# EAGLE design LowduinoPTH (EAGLE 7.2.0)
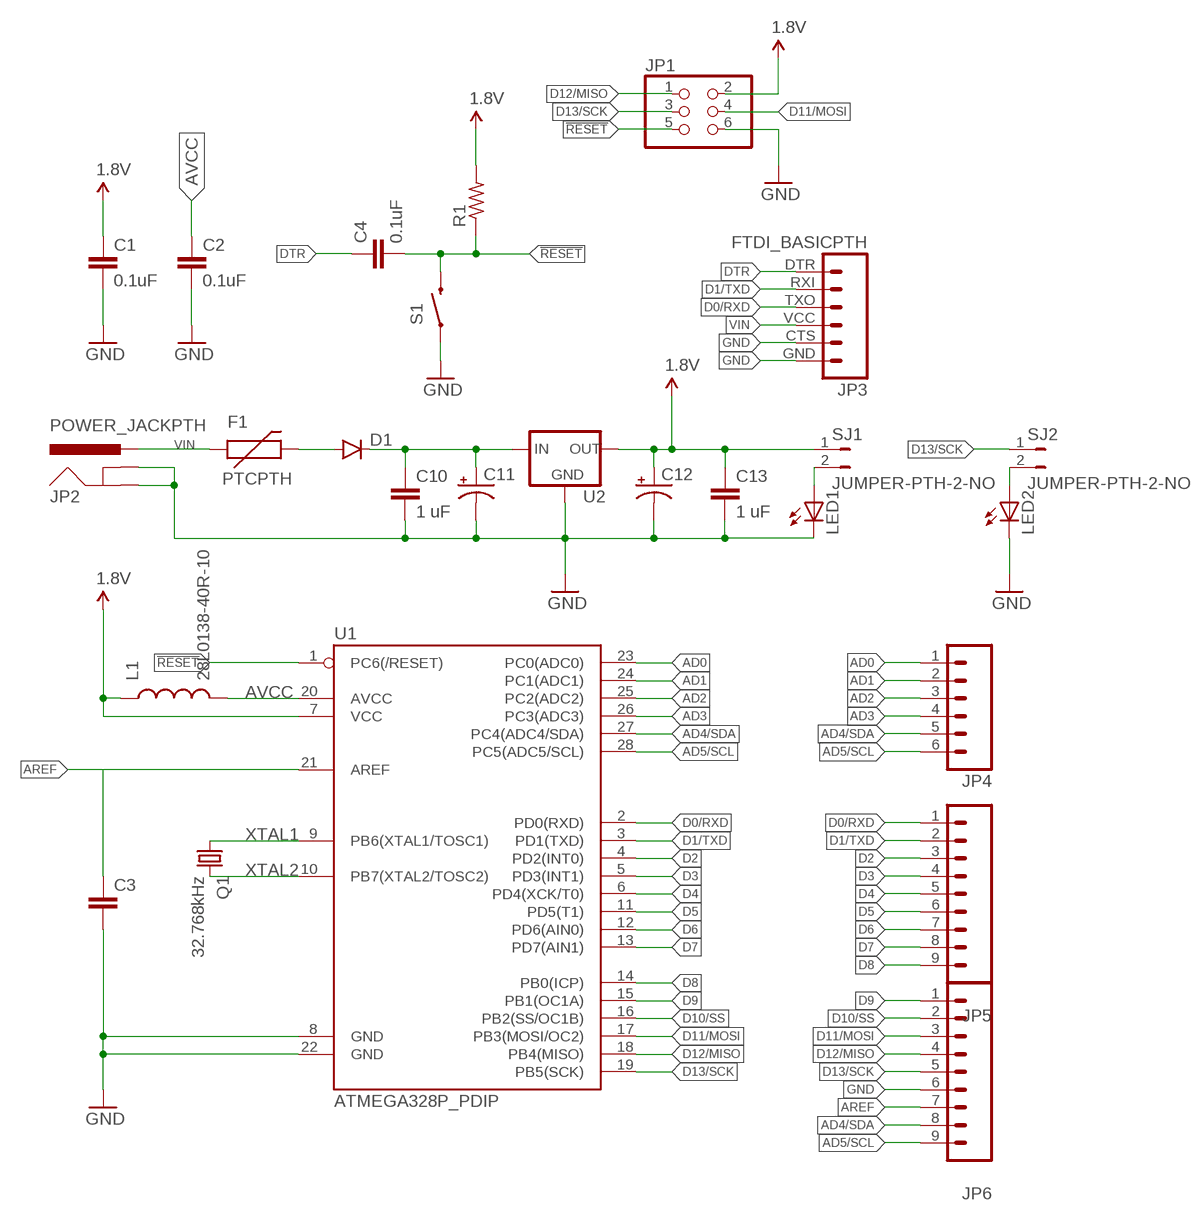
[diagram p0: schematic, sheet 1]

## Parts
C1  0.1uF  CAPPTH2  [CAP-PTH-SMALL2]
C2  0.1uF  CAPPTH1  [CAP-PTH-5MM]
C3  CAPPTH2  [CAP-PTH-SMALL2]
C4  0.1uF  CAPPTH3  [CAP-PTH-LARGE]
C10  1 uF  CAPPTH2  [CAP-PTH-SMALL2]
C11  CPOL-USE2.5-6  [E2,5-6]
C12  CPOL-USE2.5-6  [E2,5-6]
C13  1 uF  CAPPTH2  [CAP-PTH-SMALL2]
D1  DIODEPTH  [DIODE-1N4001]
F1  PTCPTH  [PTC]
JP1  PINHD-2X3  [2X03]
JP2  POWER_JACKPTH  [POWER_JACK_PTH]
JP3  FTDI_BASICPTH  [FTDI_BASIC]
JP4  M06SILK_FEMALE_PTH  [1X06]
JP5  M09  [1X09]
JP6  M09  [1X09]
L1  28L0138-40R-10  INDUCTORAXIAL-0.6  [AXIAL-0.6]
LED1  LED3MM  [LED3MM]
LED2  LED3MM  [LED3MM]
Q1  32.768kHz  CRYSTALTC26H  [TC26H]
R1  R-US_0207/10  [0207/10]
S1  SWITCH-MOMENTARY-2PTH  [TACTILE-PTH]
SJ1  JUMPER-PTH-2-NO  [PTH-JUMPER-2-NO_NO_SILK]
SJ2  JUMPER-PTH-2-NO  [PTH-JUMPER-2-NO_NO_SILK]
U1  ATMEGA328P_PDIP  [DIL28-3]
U2  V_REG_78XXTO-92_UNTESTED  [TO-92]

## Nets
1.8V: C1.1 C12.+ C13.1 JP1.2 L1.P$1 R1.2 SJ1.1 U1.7(VCC) U2.3(OUT)
!RESET: C4.2 JP1.5 R1.1 S1.3 U1.1(PC6(/RESET))
AD0: JP4.1 U1.23(PC0(ADC0))
AD1: JP4.2 U1.24(PC1(ADC1))
AD2: JP4.3 U1.25(PC2(ADC2))
AD3: JP4.4 U1.26(PC3(ADC3))
AD4/SDA: JP4.5 JP6.8 U1.27(PC4(ADC4/SDA))
AD5/SCL: JP4.6 JP6.9 U1.28(PC5(ADC5/SCL))
AREF: C3.1 JP6.7 U1.21(AREF)
AVCC: C2.1 L1.P$2 U1.20(AVCC)
D0/RXD: JP3.TXO JP5.1 U1.2(PD0(RXD))
D1/TXD: JP3.RXI JP5.2 U1.3(PD1(TXD))
D2: JP5.3 U1.4(PD2(INT0))
D3: JP5.4 U1.5(PD3(INT1))
D4: JP5.5 U1.6(PD4(XCK/T0))
D5: JP5.6 U1.11(PD5(T1))
D6: JP5.7 U1.12(PD6(AIN0))
D7: JP5.8 U1.13(PD7(AIN1))
D8: JP5.9 U1.14(PB0(ICP))
D9: JP6.1 U1.15(PB1(OC1A))
D10/SS: JP6.2 U1.16(PB2(SS/OC1B))
D11/MOSI: JP1.4 JP6.3 U1.17(PB3(MOSI/OC2))
D12/MISO: JP1.1 JP6.4 U1.18(PB4(MISO))
D13/SCK: JP1.3 JP6.5 SJ2.1 U1.19(PB5(SCK))
DTR: C4.1 JP3.DTR
GND: C1.2 C2.2 C3.2 C10.2 C11.- C12.- C13.2 JP1.6 JP2.GND JP2.GNDBREAK JP3.CTS JP3.GND JP6.6 LED1.K(C) LED2.K(C) S1.1 U1.8(GND) U1.22(GND) U2.1(GND)
N$1: LED1.A SJ1.2
N$2: LED2.A SJ2.2
N$3: D1.A F1.P$2
N$7: C10.1 C11.+ D1.C U2.2(IN)
VIN: F1.P$1 JP2.PWR JP3.VCC
XTAL1: Q1.1 U1.9(PB6(XTAL1/TOSC1))
XTAL2: Q1.2 U1.10(PB7(XTAL2/TOSC2))

## Library data of the parts
C1 C3 C10 C13 = SparkFun-Capacitors:CAP: Capacitor Standard 0603 ceramic capacitor, and 0.1" leaded capacitor.
C2 C4 = SparkFun-Passives:CAP: Capacitor Standard 0603 ceramic capacitor, and 0.1" leaded capacitor.
C11 C12 = rcl:CPOL-US: POLARIZED CAPACITOR, American symbol
D1 = SparkFun-DiscreteSemi:DIODE: Diode These are standard reverse protection diodes and small signal diodes. SMA package can handle up to about 1A. SOD-323 can handle about 200mA. What the SOD-323 package when ordering, there are some mfgs out there that are 5-pin packages.
F1 = SparkFun-PowerIC:PTC: Resettable Fuse PTC Resettable Fuse. Spark Fun Electronics SKU : COM-08357
JP1 = pinhead:PINHD-2X3: PIN HEADER
JP2 = SparkFun-Connectors:POWER_JACK: Power Jack This is the standard 5.5mm barrel jack for power. The PTH is the most common, proven, reliable, footprint. The Slot footprint only works if the mill layer is transmitted to the PCB fab house so be warned. Mating wall wart : TOL-00298 (and others); PROD_ID: CONN-08197
JP3 = SparkFun-Connectors:FTDI_BASIC: FTDI Basic header with labels
JP4 = SparkFun-Connectors:M06: Header 6 Standard 6-pin 0.1" header. Use with straight break away headers (SKU : PRT-00116), right angle break away headers (PRT-00553), swiss pins (PRT-00743), machine pins (PRT-00117), and female headers (PRT-00115). Molex polarized connector foot print use with SKU : PRT-08094 with associated crimp pins and housings. NOTES ON THE VARIANTS LOCK and LOCK_LONGPADS... This footprint was designed to help hold the alignment of a through-hole component (i.e. 6-pin header) while soldering it into place. You may notice that each hole has been shifted either up or down by 0.005 of an inch from it's more standard position (which is a perfectly straight line). This slight alteration caused the pins (the squares in the middle) to touch the edges of the holes. Because they are alternating, it causes a "brace" to hold the component in place. 0.005 has proven to be the perfect amount of "off-center" position when using our standard breakaway headers. Although looks a little odd when you look at the bare footprint, once you have a header in there, the alteration is very hard to notice. Also,if you push a header all the way into place, it is covered up entirely on the bottom side. This idea of altering the position of holes to aid alignment will be further integrated into the Sparkfun Library for other footprints. It can help hold any component with 3 or more connection pins.; PROD_ID: CONN-08437
JP5 JP6 = SparkFun-Connectors:M09: Header 9 Standard 9-pin 0.1" header. Use with straight break away headers (SKU : PRT-00116), right angle break away headers (PRT-00553), swiss pins (PRT-00743), machine pins (PRT-00117), and female headers (PRT-00115).
L1 = SparkFun-Passives:INDUCTOR: Inductors Basic Inductor/Choke - 0603 and 1206. Footprints are not proven and vary greatly between part numbers. SRN6045- 33uH, 20% 1.4A SDR0403-560KL - 56uH, 10%, 500mA RMS/740mA peak
LED1 LED2 = led:LED: LED OSRAM: - CHIPLED LG R971, LG N971, LY N971, LG Q971, LY Q971, LO R971, LY R971 LH N974, LH R974 LS Q976, LO Q976, LY Q976 LO Q996 - Hyper CHIPLED LW Q18S LB Q993, LB Q99A, LB R99A - SideLED LS A670, LO A670, LY A670, LG A670, LP A670 LB A673, LV A673, LT A673, LW A673 LH A674 LY A675 LS A676, LA A676, LO A676, LY A676, LW A676 LS A679, LY A679, LG A679 - Hyper Micro SIDELED® LS Y876, LA Y876, LO Y876, LY Y876 LT Y87S - SmartLED LW L88C, LW L88S LB L89C, LB L89S, LG L890 LS L89K, LO L89K, LY L89K LS L896, LA L896, LO L896, LY L896 - TOPLED LS T670, LO T670, LY T670, LG T670, LP T670 LSG T670, LSP T670, LSY T670, LOP T670, LYG T670 LG T671, LOG T671, LSG T671 LB T673, LV T673, LT T673, LW T673 LH T674 LS T676, LA T676, LO T676, LY T676, LB T676, LH T676, LSB T676, LW T676 LB T67C, LV T67C, LT T67C, LS T67K, LO T67K, LY T67K, LW E67C LS E67B, LA E67B, LO E67B, LY E67B, LB E67C, LV E67C, LT E67C LW T67C LS T679, LY T679, LG T679 LS T770, LO T770, LY T770, LG T770, LP T770 LB T773, LV T773, LT T773, LW T773 LH T774 LS E675, LA E675, LY E675, LS T675 LS T776, LA T776, LO T776, LY T776, LB T776 LHGB T686 LT T68C, LB T68C - Hyper Mini TOPLED® LB M676 - Mini TOPLED Santana® LG M470 LS M47K, LO M47K, LY M47K Source: http://www.osram.convergy.de LUXEON: - LUMILED® LXK2-PW12-R00, LXK2-PW12-S00, LXK2-PW14-U00, LXK2-PW14-V00 LXK2-PM12-R00, LXK2-PM12-S00, LXK2-PM14-U00 LXK2-PE12-Q00, LXK2-PE12-R00, LXK2-PE12-S00, LXK2-PE14-T00, LXK2-PE14-U00 LXK2-PB12-K00, LXK2-PB12-L00, LXK2-PB12-M00, LXK2-PB14-N00, LXK2-PB14-P00, LXK2-PB14-Q00 LXK2-PR12-L00, LXK2-PR12-M00, LXK2-PR14-Q00, LXK2-PR14-R00 LXK2-PD12-Q00, LXK2-PD12-R00, LXK2-PD12-S00 LXK2-PH12-R00, LXK2-PH12-S00 LXK2-PL12-P00, LXK2-PL12-Q00, LXK2-PL12-R00 Source: www.luxeon.com KINGBRIGHT: KA-3528ASYC Source: www.kingbright.com
Q1 = SparkFun-FreqCtrl:CRYSTAL: Various standard crystals. Proven footprints.; PROD_ID: XTAL-10112
R1 = rcl:R-US_: RESISTOR, American symbol
S1 = SparkFun-Electromechanical:SWITCH-MOMENTARY-2: Various NO switches- pushbuttons, reed, etc; PROD_ID: SWCH-08441
SJ1 SJ2 = SparkFun-Passives:JUMPER-PTH-2-NO
U1 = SparkFun-DigitalIC:ATMEGA328P_PDIP: uC used in the Arduino 32kb flash, 1k EEPROM, 2k SRAM This is the through-hole version of this chip.
U2 = SparkFun-PowerIC:V_REG_78XX: Voltage Regulator Standard 78xx regulator. IGO (Input Ground Output). Spark Fun Electronics SKU : COM-00107

## Board
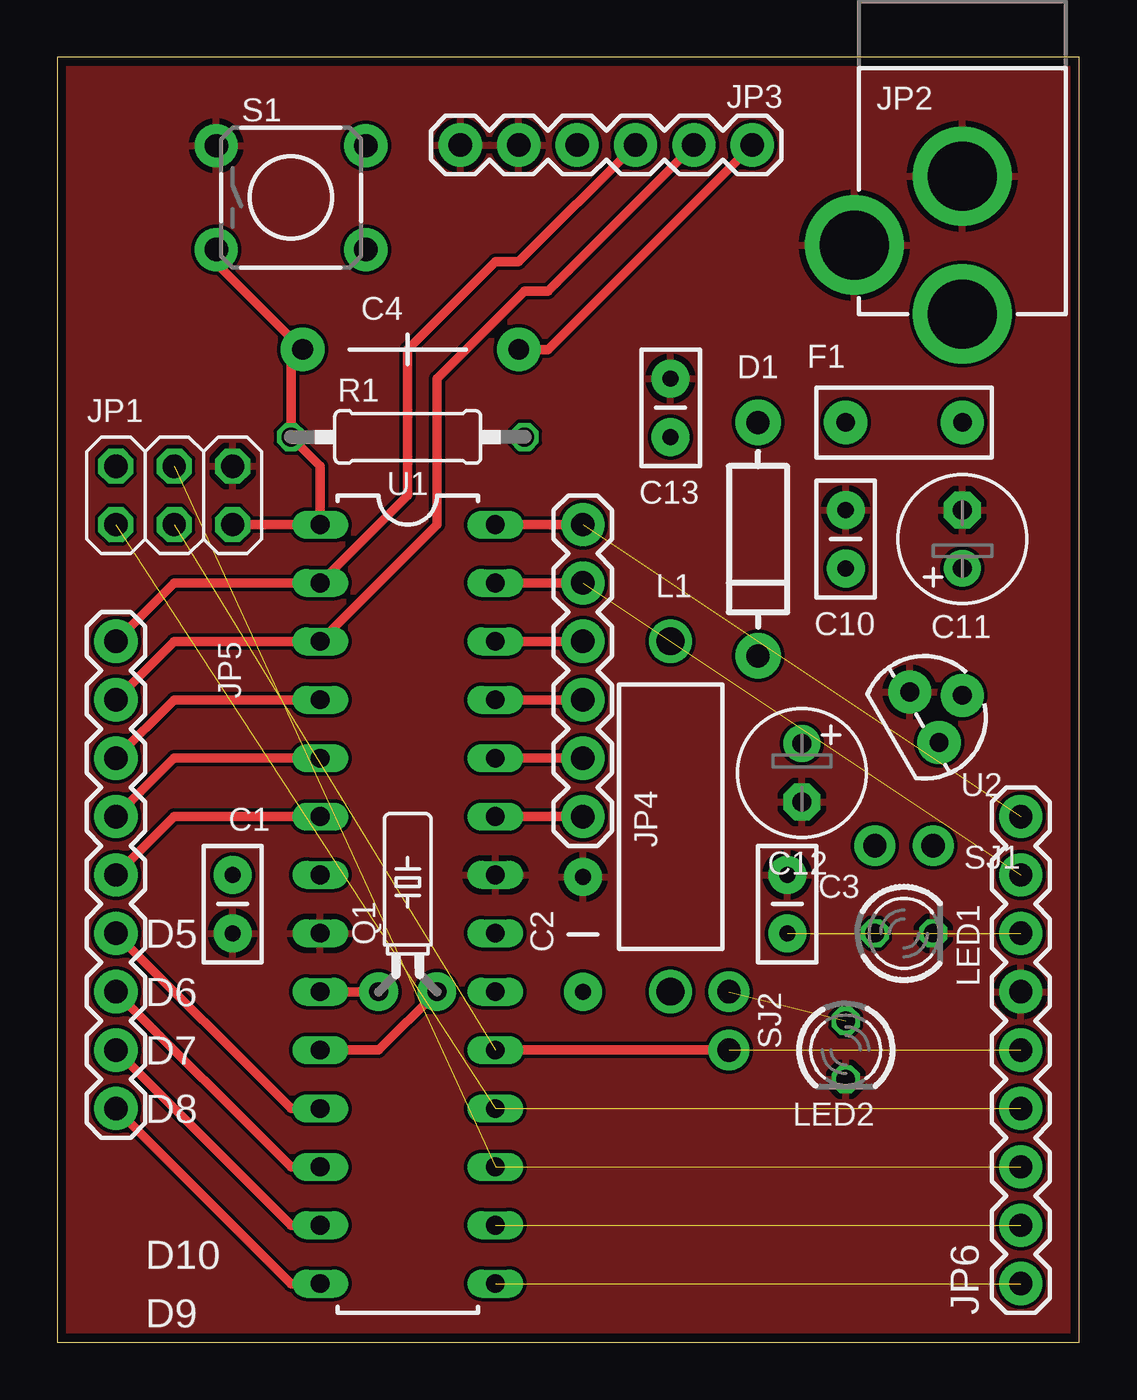
[diagram p1: board, top side]
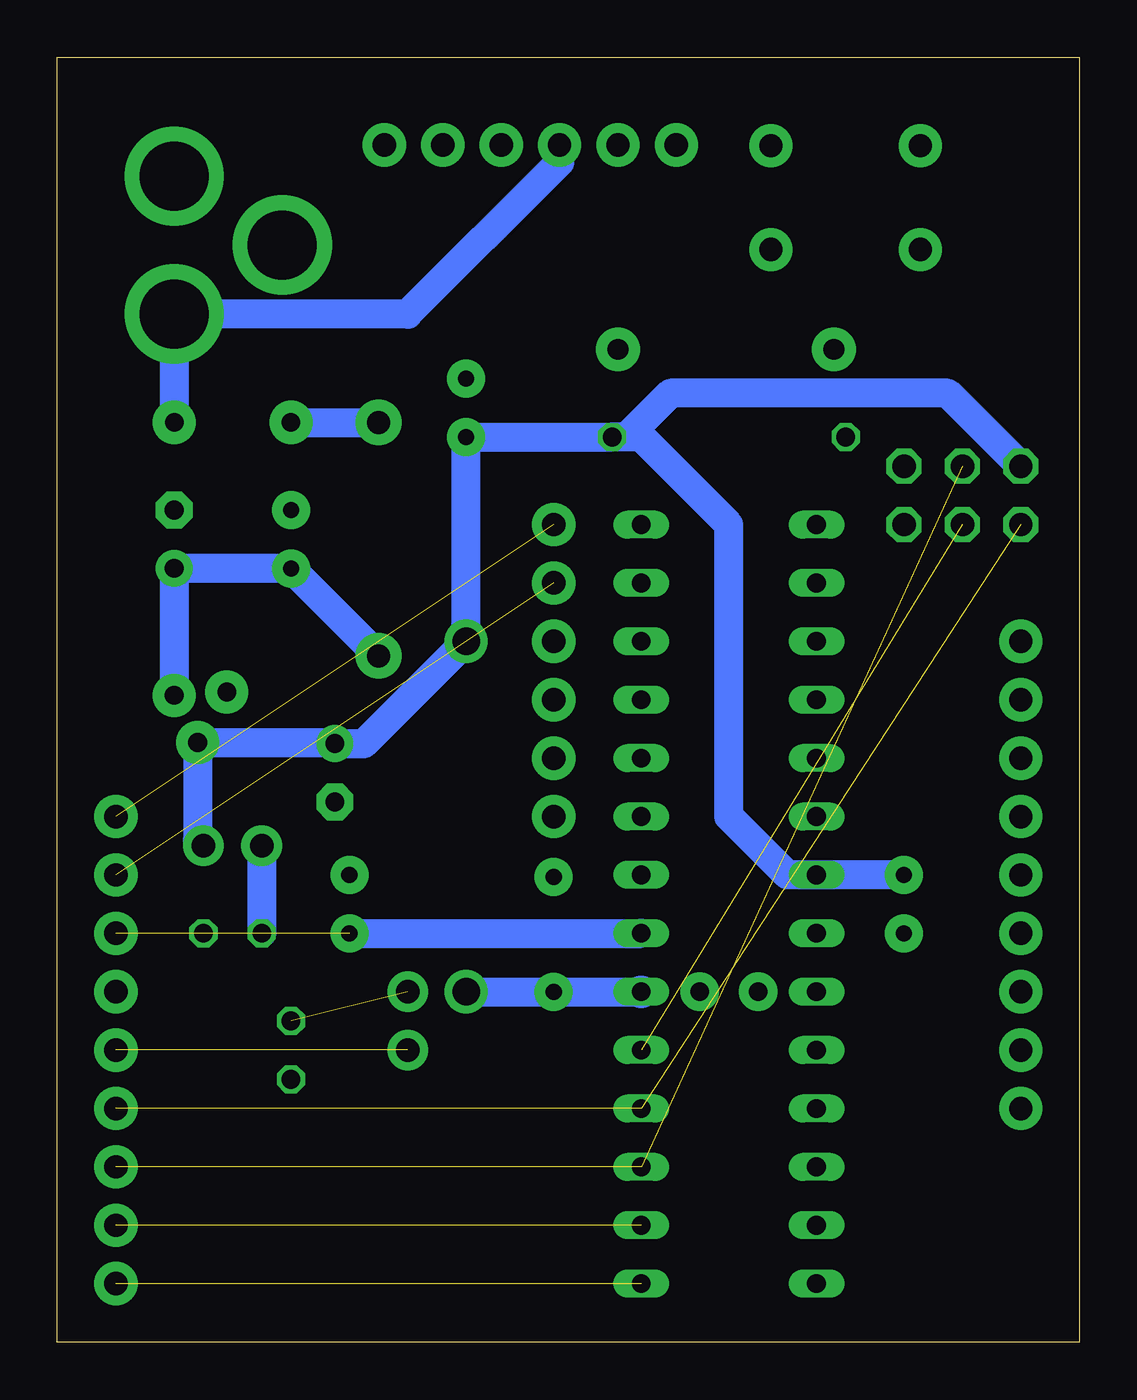
[diagram p2: board, bottom side, seen from below]

Size 44.45 x 55.88 mm. Coordinates in mm from the lower left corner, seen from the top.
Outline: 44.45,55.88 0,55.88 0,0 44.45,0 44.45,55.88
Copper layers (1*16): Top 0.0356mm / dielectric 1.5011mm / Bottom 0.0356mm
Design rules "oshpark-2layer *": minimum track width 6mil, minimum drill 13mil, track to track 6mil, track to pad 6mil, pad to pad 6mil, via to via 6mil, smd to smd 6mil, copper to edge 15mil, drill to drill 6mil, minimum pad ring 7mil, minimum via ring 7mil, stop-mask expansion 4mil, vias tented up to drill 0mil, thermal gap 10mil

### Footprints (pad centres in the part's own frame; a part is rotated, then mirrored left to right if it is on the bottom)
CAP-PTH-SMALL2 = drill 0.7 pad 1.651: 1 0,0; 2 2.54,0
CAP-PTH-5MM = drill 0.7 pad 1.651: 1 -2.5,0; 2 2.5,0
CAP-PTH-LARGE = drill 0.9 pad 1.905: 1 -4.826,0; 2 4.572,0
E2,5-6 = drill 0.813 pad 1.6: + -1.27,0 | drill 0.813 pad 1.6 octagon: - 1.27,0
DIODE-1N4001 = drill 1 pad 1.981: A -5.08,0; C 5.08,0
PTC = drill 0.8 pad 1.88: P$1 -2.54,0; P$2 2.54,0
2X03 = drill 1.016 octagon: 1 -2.54,-1.27; 2 -2.54,1.27; 3 0,-1.27; 4 0,1.27; 5 2.54,-1.27; 6 2.54,1.27
POWER_JACK_PTH = drill 2.997 pad 4.318: GND 0,7.7; GNDBREAK 4.7,10.7; PWR 0,13.7
FTDI_BASIC = drill 1.016 pad 1.88: CTS 10.16,0; DTR 0,0; GND 12.7,0; RXI 2.54,0; TXO 5.08,0; VCC 7.62,0
1X06 = drill 1.016 pad 1.88: 1 0,0; 2 2.54,0; 3 5.08,0; 4 7.62,0; 5 10.16,0; 6 12.7,0
1X09 = drill 1.016 pad 1.88: 1 0,0; 2 2.54,0; 3 5.08,0; 4 7.62,0; 5 10.16,0; 6 12.7,0; 7 15.24,0; 8 17.78,0; 9 20.32,0
AXIAL-0.6 = drill 1.2 pad 1.88: P$1 -7.62,0; P$2 7.62,0
LED3MM = drill 0.813 octagon: A -1.27,0; K 1.27,0
TC26H = drill 0.813 pad 1.676: 1 -1.27,0; 2 1.27,0
0207/10 = drill 0.813 octagon: 1 -5.08,0; 2 5.08,0
TACTILE-PTH = drill 1.016 pad 1.88: 1 -3.251,2.261; 2 3.251,2.261; 3 -3.251,-2.261; 4 3.251,-2.261
PTH-JUMPER-2-NO_NO_SILK = drill 1.016 pad 1.778: 1 -1.27,0; 2 1.27,0
DIL28-3 = drill 0.813 long: 1 -16.51,-3.81; 2 -13.97,-3.81; 3 -11.43,-3.81; 4 -8.89,-3.81; 5 -6.35,-3.81; 6 -3.81,-3.81; 7 -1.27,-3.81; 8 1.27,-3.81; 9 3.81,-3.81; 10 6.35,-3.81; 11 8.89,-3.81; 12 11.43,-3.81; 13 13.97,-3.81; 14 16.51,-3.81; 15 16.51,3.81; 16 13.97,3.81; 17 11.43,3.81; 18 8.89,3.81; 19 6.35,3.81; 20 3.81,3.81; 21 1.27,3.81; 22 -1.27,3.81; 23 -3.81,3.81; 24 -6.35,3.81; 25 -8.89,3.81; 26 -11.43,3.81; 27 -13.97,3.81; 28 -16.51,3.81
TO-92 = drill 0.813 pad 1.88: 1 -1.27,0; 2 0,1.905; 3 1.27,0

### Placement (x,y rotation side)
C1  7.62,20.32 270 top
C2  22.86,17.73 90 top
C3  31.75,17.78 90 top
C4  15.24,43.18 180 top
C10  34.29,33.66 90 top
C11  39.37,34.92 90 top
C12  32.38,24.77 270 top
C13  26.67,39.37 90 top
D1  30.48,34.92 270 top
F1  36.83,40.01 180 top
JP1  5.08,36.83 0 top
JP2  39.37,58.42 180 top
JP3  30.23,52.07 180 top
JP4  22.86,22.86 90 top
JP5  2.54,30.48 270 top
JP6  41.91,2.54 90 top
L1  26.67,22.86 270 top
LED1  36.83,17.78 0 top
LED2  34.29,12.7 270 top
Q1  15.24,15.24 0 top
R1  15.24,39.37 0 top
S1  10.16,49.78 0 top
SJ1  36.83,21.59 180 top
SJ2  29.21,13.97 90 top
U1  15.24,19.05 270 top
U2  37.72,27.18 300 top

### Tracks (layer width: path | path; a pad name or v marks a point on that pad's centre or on a via)
1.8V
  Bottom 1.27: 32.43,26.08 U2.3 38.35,21.84 SJ1.1 | C12.+ 31.11,26.04 L1.P$1 C13.1 R1.2 19.68,39.37 | C1.1 U1.7 12.7,20.32 15.24,22.86 15.24,35.56 19.05,39.37 19.68,39.37 | JP1.2 5.71,41.27 17.78,41.27 19.68,39.37
  Bottom 1.422: 32.43,26.08 C12.+
!RESET
  Top 0.406: JP1.5 U1.1 11.43,38.1 R1.1 10.16,42.67 C4.2 6.91,46.94 S1.3
AD0
  Top 0.406: U1.23 JP4.1
AD1
  Top 0.406: JP4.2 U1.24
AD2
  Top 0.406: U1.25 JP4.3
AD3
  Top 0.406: JP4.4 U1.26
AD4/SDA  (1 unrouted)
  Top 0.406: U1.27 JP4.5
AD5/SCL  (1 unrouted)
  Top 0.406: JP4.6 U1.28
AREF  (1 unrouted)
  Bottom 1.27: C3.1 U1.21
AVCC
  Bottom 1.27: L1.P$2 C2.1 | C2.1 19.06,15.23
  Bottom 1.422: C2.1 | 19.06,15.23 U1.20
D0/RXD
  Top 0.406: JP3.TXO 20.07,46.99 19.05,46.99 15.24,43.18 15.24,36.83 U1.2 5.08,33.02 JP5.1
D1/TXD
  Top 0.406: JP3.RXI 21.34,45.72 20.32,45.72 16.51,41.91 16.51,35.56 U1.3 5.08,30.48 JP5.2
D2
  Top 0.406: U1.4 5.08,27.94 JP5.3
D3
  Top 0.406: U1.5 5.08,25.4 JP5.4
D4
  Top 0.406: U1.6 5.08,22.86 JP5.5
D5
  Top 0.406: U1.11 10.16,10.16 JP5.6
D6
  Top 0.406: U1.12 10.16,7.62 JP5.7
D7
  Top 0.406: U1.13 10.16,5.08 JP5.8
D8
  Top 0.406: U1.14 10.16,2.54 JP5.9
D9  (1 unrouted)
D10/SS  (1 unrouted)
D11/MOSI  (2 unrouted)
D12/MISO  (2 unrouted)
D13/SCK  (2 unrouted)
  Top 0.406: U1.19 SJ2.1
DTR
  Top 0.406: C4.1 21.34,43.18 JP3.DTR
GND
  pour Top: 44.45,55.88 0,55.88 0,0 44.45,0
N$1
  Bottom 1.27: SJ1.2 LED1.A
N$2  (1 unrouted)
N$3
  Bottom 1.27: F1.P$2 D1.A
N$7
  Bottom 1.27: D1.C C10.1 C11.+ U2.2
  Bottom 1.422: U2.2
VIN
  Bottom 1.27: F1.P$1 JP2.PWR 39.35,44.7 29.21,44.7 22.61,51.31 JP3.VCC
XTAL1
  Top 0.406: U1.9 Q1.1
XTAL2
  Top 0.406: U1.10 13.97,12.7 Q1.2

### Text on the board
tNames: D5 | D6 | D7 | D8 | D10 | D9